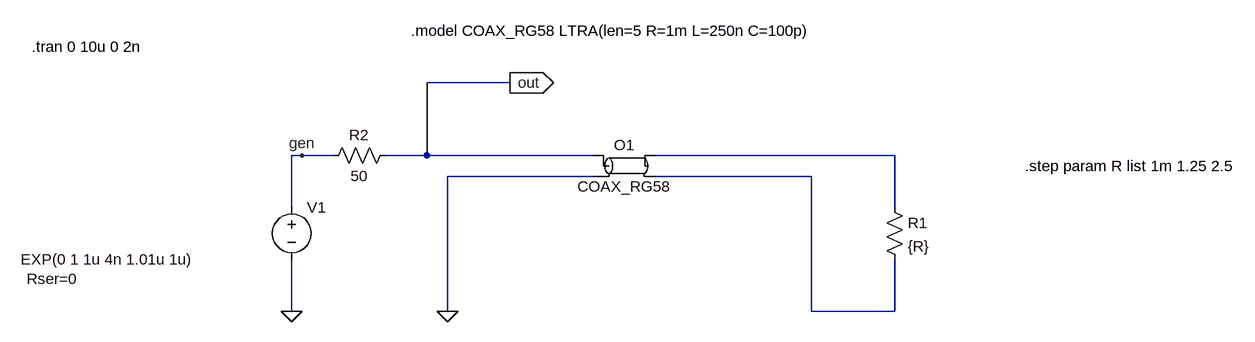
[diagram p0: schematic coaxial_cable_pulse_shortening.asc]
coaxial_cable_pulse_shortening.asc, the LTspice schematic file:
Version 4
SHEET 1 1332 680
WIRE 0 16 -128 16
WIRE -320 128 -336 128
WIRE -272 128 -320 128
WIRE -128 128 -128 16
WIRE -128 128 -192 128
WIRE 128 128 -128 128
WIRE 592 128 224 128
WIRE 128 160 -96 160
WIRE 464 160 224 160
WIRE -336 208 -336 128
WIRE 592 208 592 128
WIRE -336 368 -336 288
WIRE -96 368 -96 160
WIRE 464 368 464 160
WIRE 592 368 592 288
WIRE 592 368 464 368
FLAG -336 368 0
FLAG -96 368 0
FLAG -320 128 gen
FLAG 0 16 out
IOPIN 0 16 Out
SYMBOL res 576 192 R0
SYMATTR InstName R1
SYMATTR Value {R}
SYMBOL voltage -336 192 R0
WINDOW 3 -417 96 Left 2
WINDOW 123 0 0 Left 0
WINDOW 39 -408 126 Left 2
SYMATTR Value EXP(0 1 1u 4n 1.01u 1u)
SYMATTR SpiceLine Rser=0
SYMATTR InstName V1
SYMBOL ltline 176 144 R0
SYMATTR InstName O1
SYMATTR Value COAX_RG58
SYMBOL res -176 112 R90
WINDOW 0 0 56 VBottom 2
WINDOW 3 32 56 VTop 2
SYMATTR InstName R2
SYMATTR Value 50
TEXT -152 -64 Left 2 !.model COAX_RG58 LTRA(len=5 R=1m L=250n C=100p)
TEXT -736 -40 Left 2 !.tran 0 10u 0 2n
TEXT 792 144 Left 2 !.step param R list 1m 1.25 2.5

The netlist it stands for:
* coaxial_cable_pulse_shortening.asc
R1 N001 N002 {R}
V1 gen 0 EXP(0 1 1u 4n 1.01u 1u) Rser=0
O1 out 0 N001 N002 COAX_RG58
R2 out gen 50
.model COAX_RG58 LTRA(len=5 R=1m L=250n C=100p)
.tran 0 10u 0 2n
.step param R list 1m 1.25 2.5
.backanno
.end